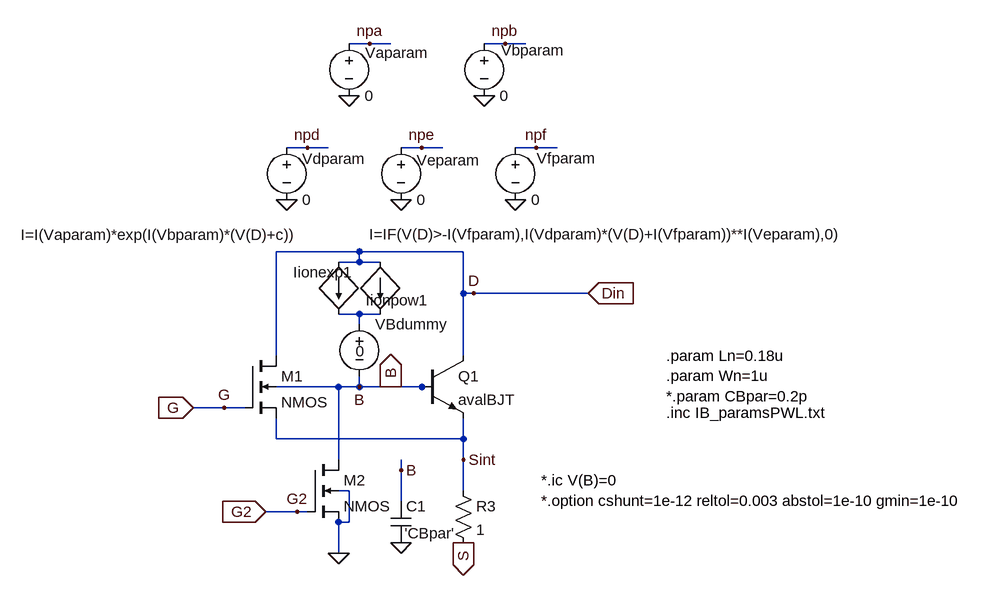
[diagram p0: schematic 2TNSRAM.asc]
2TNSRAM.asc, the LTspice schematic file:
Version 4
SHEET 1 3052 680
WIRE 656 -368 624 -368
WIRE 688 -368 656 -368
WIRE 864 -368 832 -368
WIRE 896 -368 864 -368
WIRE 560 -208 528 -208
WIRE 592 -208 560 -208
WIRE 736 -208 704 -208
WIRE 768 -208 736 -208
WIRE 912 -208 880 -208
WIRE 944 -208 912 -208
WIRE 640 -48 512 -48
WIRE 800 -48 640 -48
WIRE 640 -32 640 -48
WIRE 640 -32 608 -32
WIRE 672 -32 640 -32
WIRE 800 16 800 -48
WIRE 816 16 800 16
WIRE 992 16 816 16
WIRE 640 48 608 48
WIRE 672 48 640 48
WIRE 640 64 640 48
WIRE 512 112 512 -48
WIRE 800 112 800 16
WIRE 608 160 512 160
WIRE 640 160 640 144
WIRE 640 160 608 160
WIRE 688 160 640 160
WIRE 736 160 688 160
WIRE 752 160 736 160
WIRE 432 192 384 192
WIRE 464 192 432 192
WIRE 512 240 512 208
WIRE 800 240 800 208
WIRE 800 240 512 240
WIRE 608 272 608 160
WIRE 800 272 800 240
WIRE 704 288 704 272
WIRE 624 320 608 320
WIRE 800 320 800 272
WIRE 704 336 704 288
WIRE 544 352 496 352
WIRE 560 352 544 352
WIRE 624 368 624 320
WIRE 624 368 608 368
WIRE 608 416 608 368
FLAG 640 160 B
FLAG 800 272 Sint
FLAG 816 16 D
FLAG 704 400 0
FLAG 704 288 B
FLAG 608 416 0
FLAG 432 192 G
FLAG 544 352 G2
FLAG 624 -288 0
FLAG 656 -368 npa
FLAG 832 -288 0
FLAG 864 -368 npb
FLAG 528 -128 0
FLAG 560 -208 npd
FLAG 704 -128 0
FLAG 736 -208 npe
FLAG 880 -128 0
FLAG 912 -208 npf
FLAG 384 192 G
IOPIN 384 192 In
FLAG 496 352 G2
IOPIN 496 352 In
FLAG 992 16 Din
IOPIN 992 16 In
FLAG 800 400 S
IOPIN 800 400 Out
FLAG 688 160 B
IOPIN 688 160 Out
SYMBOL npn 736 112 R0
SYMATTR InstName Q1
SYMATTR Value avalBJT
SYMATTR Value2 area=AreaPar
SYMBOL res 784 304 R0
SYMATTR InstName R3
SYMATTR Value 1
SYMBOL nmos4 464 112 R0
SYMATTR InstName M1
SYMATTR Value2 l='Ln' w='Wn' m=1
SYMBOL cap 688 336 R0
WINDOW 3 22 49 Left 2
SYMATTR Value 'CBpar'
SYMATTR InstName C1
SYMATTR SpiceLine Rser=1m
SYMBOL nmos4 560 272 R0
SYMATTR InstName M2
SYMATTR Value2 l='Ln*10' w='Wn' m=1
SYMBOL bi 608 -32 R0
WINDOW 3 -489 -42 Left 2
WINDOW 0 -70 16 Left 2
SYMATTR Value I=I(Vaparam)*exp(I(Vbparam)*(V(D)+c))
SYMATTR InstName Iionexp1
SYMBOL bi 672 -32 R0
WINDOW 3 -17 -43 Left 2
WINDOW 0 -22 59 Left 2
SYMATTR Value I=IF(V(D)>-I(Vfparam),I(Vdparam)*(V(D)+I(Vfparam))**I(Veparam),0)
SYMATTR InstName Iionpow1
SYMBOL voltage 624 -384 R0
WINDOW 0 25 30 Left 2
SYMATTR InstName Vaparam
SYMATTR Value 0
SYMATTR Prefix ""
SYMBOL voltage 832 -384 R0
WINDOW 0 26 26 Left 2
SYMATTR InstName Vbparam
SYMATTR Value 0
SYMATTR Prefix ""
SYMBOL voltage 528 -224 R0
WINDOW 0 24 33 Left 2
SYMATTR InstName Vdparam
SYMATTR Value 0
SYMATTR Prefix ""
SYMBOL voltage 704 -224 R0
WINDOW 0 24 35 Left 2
SYMATTR InstName Veparam
SYMATTR Value 0
SYMATTR Prefix ""
SYMBOL voltage 880 -224 R0
WINDOW 0 33 32 Left 2
SYMATTR InstName Vfparam
SYMATTR Value 0
SYMATTR Prefix ""
SYMBOL voltage 640 48 R0
WINDOW 3 -6 57 Left 2
SYMATTR Value 0
SYMATTR InstName VBdummy
SYMATTR Prefix ""
TEXT 1112 112 Left 2 !.param Ln=0.18u\n.param Wn=1u\n*.param CBpar=0.2p
TEXT 920 304 Left 2 !*.ic V(B)=0\n*.option cshunt=1e-12 reltol=0.003 abstol=1e-10 gmin=1e-10
TEXT 1112 200 Left 2 !.inc IB_paramsPWL.txt

The netlist it stands for:
* 2TNSRAM.asc
Q1 Din B Sint 0 avalBJT area=AreaPar
R3 Sint S 1
M1 Din G Sint B NMOS l='Ln' w='Wn' m=1
C1 B 0 'CBpar' Rser=1m
M2 B G2 0 0 NMOS l='Ln*10' w='Wn' m=1
B§Iionexp1 Din N001 I=I(Vaparam)*exp(I(Vbparam)*(V(D)+c))
B§Iionpow1 Din N001 I=IF(V(D)>-I(Vfparam),I(Vdparam)*(V(D)+I(Vfparam))**I(Veparam),0)
XVaparam npa 0 0  ; pins + -
XVbparam npb 0 0  ; pins + -
XVdparam npd 0 0  ; pins + -
XVeparam npe 0 0  ; pins + -
XVfparam npf 0 0  ; pins + -
XVBdummy N001 B 0  ; pins + -
.model NPN NPN
.model PNP PNP
.lib standard.bjt
.model NMOS NMOS
.model PMOS PMOS
.lib standard.mos
.param Ln=0.18u
.param Wn=1u
*.param CBpar=0.2p
*.ic V(B)=0
*.option cshunt=1e-12 reltol=0.003 abstol=1e-10 gmin=1e-10
.inc IB_paramsPWL.txt
.backanno
.end